# EAGLE schematic tinyRF (EAGLE 6.4)
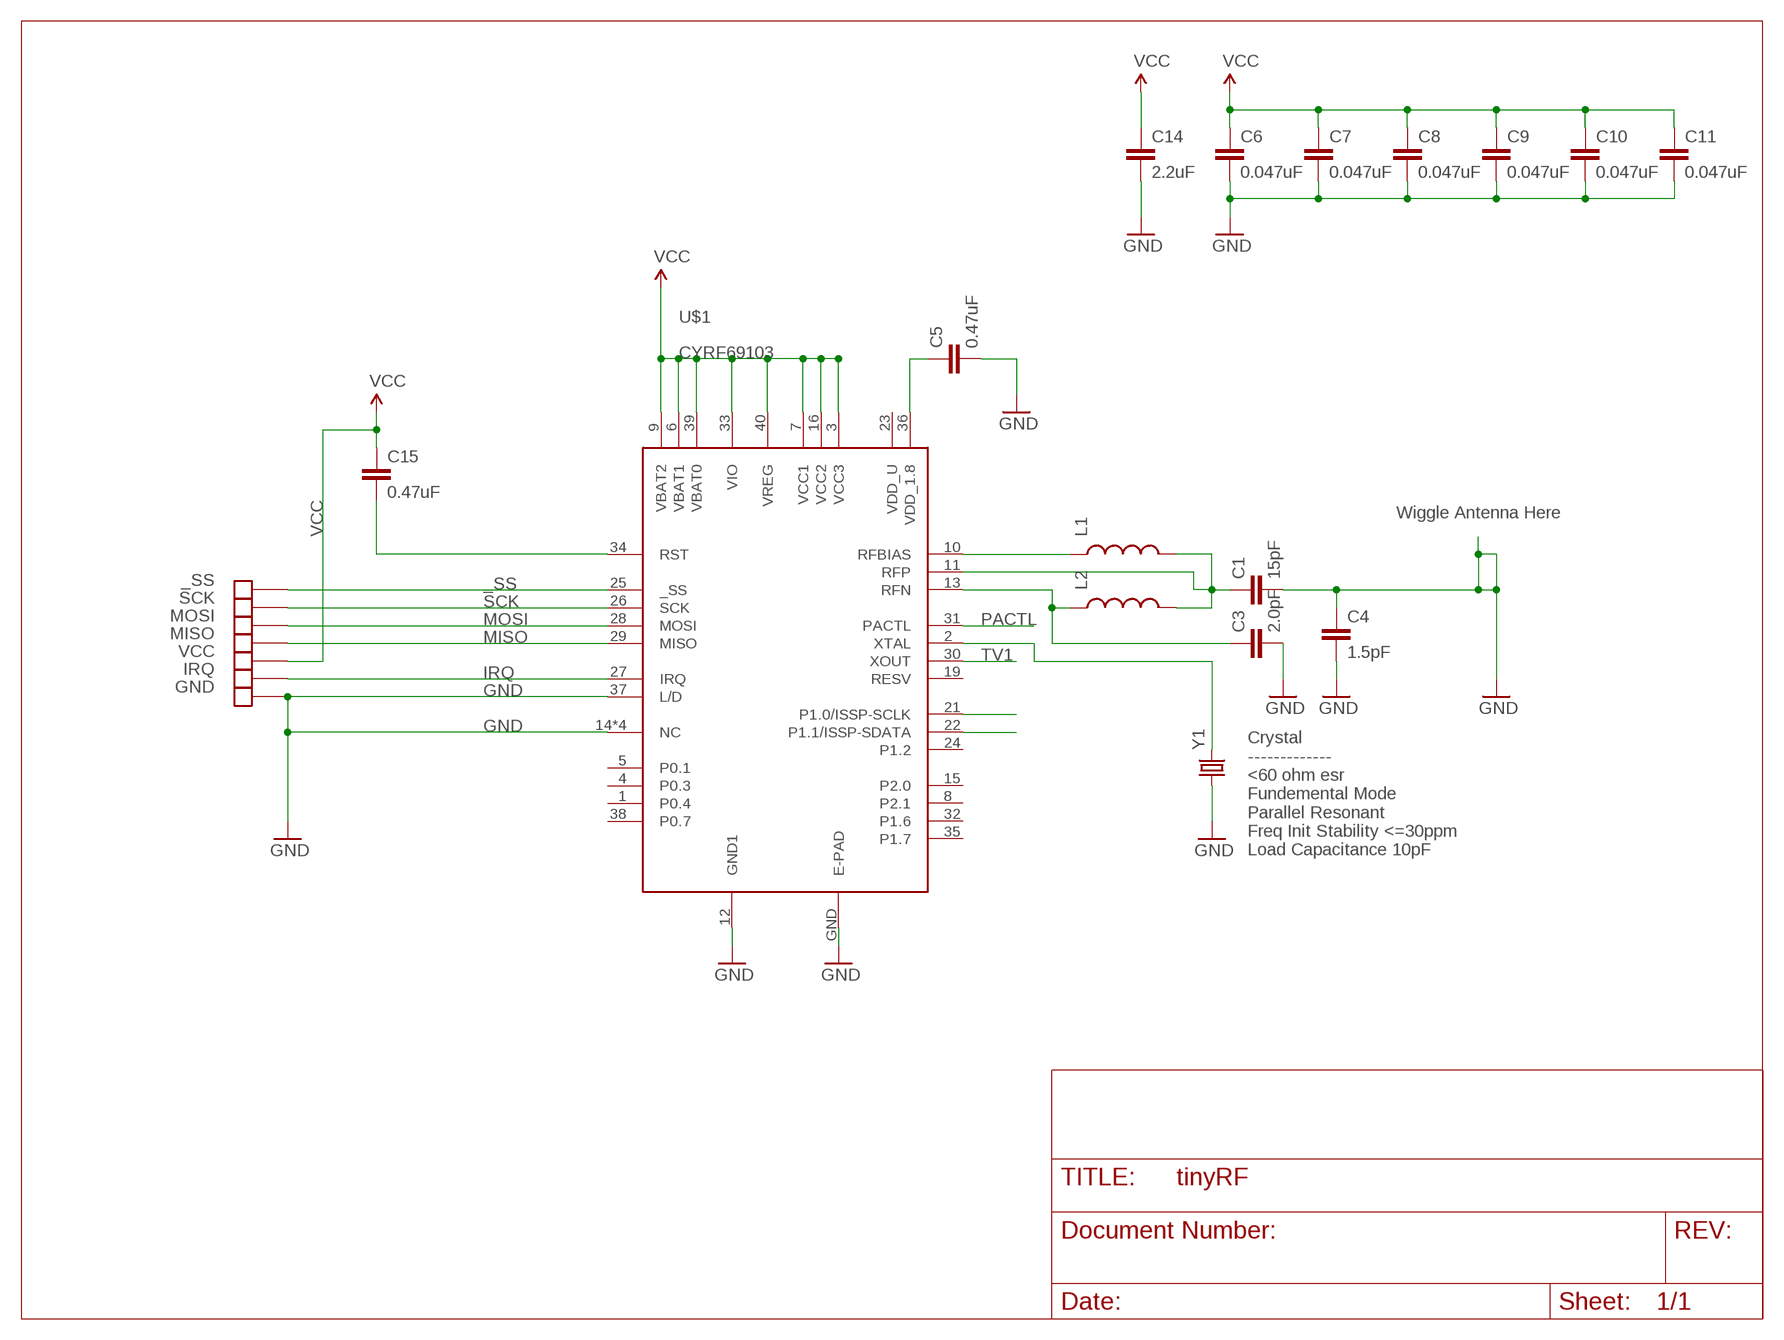
[diagram p0: schematic, sheet 1]

## Parts
_SS  SOLDER_PAD.05X.05  [SOLDER_PAD_.05X.05]
C1  15pF  CAP0402-CAP  [0402-CAP]
C3  2.0pF  CAP0402-CAP  [0402-CAP]
C4  1.5pF  CAP0402-CAP  [0402-CAP]
C5  0.47uF  CAP0402-CAP  [0402-CAP]
C6  0.047uF  CAP0402-CAP  [0402-CAP]
C7  0.047uF  CAP0402-CAP  [0402-CAP]
C8  0.047uF  CAP0402-CAP  [0402-CAP]
C9  0.047uF  CAP0402-CAP  [0402-CAP]
C10  0.047uF  CAP0402-CAP  [0402-CAP]
C11  0.047uF  CAP0402-CAP  [0402-CAP]
C14  2.2uF  CAP0805  [0805]
C15  0.47uF  CAP0402-CAP  [0402-CAP]
GND  SOLDER_PAD.05X.05  [SOLDER_PAD_.05X.05]
IRQ  SOLDER_PAD.05X.05  [SOLDER_PAD_.05X.05]
L1  INDUCTOR0603  [0603]
L2  INDUCTOR0402  [C0402]
MISO  SOLDER_PAD.05X.05  [SOLDER_PAD_.05X.05]
MOSI  SOLDER_PAD.05X.05  [SOLDER_PAD_.05X.05]
SCK  SOLDER_PAD.05X.05  [SOLDER_PAD_.05X.05]
U$1  CYRF69103  [QFN40]
VCC  SOLDER_PAD.05X.05  [SOLDER_PAD_.05X.05]
Y1  CRYSTAL5X3  [CRYSTAL-SMD-5X3]

## Nets
_SS: _SS.P$1(NET) U$1.25(_SS)
GND: C1.2 C3.2 C4.1 C4.2 C5.2 C6.2 C7.2 C8.2 C9.2 C10.2 C11.2 C14.2 GND.P$1(NET) U$1.12(GND1) U$1.14(NC) U$1.17(NC) U$1.18(NC) U$1.20(NC) U$1.37(L/D) U$1.GND(E-PAD) Y1.1
IRQ: IRQ.P$1(NET) U$1.27(IRQ)
MISO: MISO.P$1(NET) U$1.29(MISO)
MOSI: MOSI.P$1(NET) U$1.28(MOSI)
N$2: U$1.2(XTAL) Y1.3
N$4: U$1.21(P1.0/ISSP-SCLK)
N$5: U$1.22(P1.1/ISSP-SDATA)
RFBIAS: L1.1 U$1.10(RFBIAS)
RFN: C3.1 L2.1 U$1.13(RFN)
RFP: C1.1 L1.2 L2.2 U$1.11(RFP)
RST: C15.2 U$1.34(RST)
SCK: SCK.P$1(NET) U$1.26(SCK)
VCC: C6.1 C7.1 C8.1 C9.1 C10.1 C11.1 C14.1 C15.1 U$1.3(VCC3) U$1.6(VBAT1) U$1.7(VCC1) U$1.9(VBAT2) U$1.16(VCC2) U$1.33(VIO) U$1.39(VBAT0) U$1.40(VREG) VCC.P$1(NET)
VDD: C5.1 U$1.36(VDD_1.8)
Unconnected: U$1.1(P0.4) U$1.4(P0.3) U$1.5(P0.1) U$1.8(P2.1) U$1.15(P2.0) U$1.19(RESV) U$1.23(VDD_U) U$1.24(P1.2) U$1.30(XOUT) U$1.31(PACTL) U$1.32(P1.6) U$1.35(P1.7) U$1.38(P0.7)

## Notes on the sheet
- Wiggle Antenna Here
- Crystal
  -------------
  <60 ohm esr
  Fundemental Mode
  Parallel Resonant
  Freq Init Stability <=30ppm
  Load Capacitance 10pF

## Library data of the parts
_SS GND IRQ MISO MOSI SCK VCC = JCM:SOLDER_PAD
C1 = SparkFun-Passives:CAP: Capacitor Standard 0603 ceramic capacitor, and 0.1" leaded capacitor.; PARTNO: C0402C150J5GACTU; VOLT: 50
C3 = SparkFun-Passives:CAP: Capacitor Standard 0603 ceramic capacitor, and 0.1" leaded capacitor.; PARTNO: C0402C209C5GACTU; VOLT: 50
C4 = SparkFun-Passives:CAP: Capacitor Standard 0603 ceramic capacitor, and 0.1" leaded capacitor.; PARTNO: C0402C159B5GACTU; VOLT: 50
C5 C15 = SparkFun-Passives:CAP: Capacitor Standard 0603 ceramic capacitor, and 0.1" leaded capacitor.; PARTNO: GRM155R60J474KE19D; VOLT: 6.3
C6-C11 = SparkFun-Passives:CAP: Capacitor Standard 0603 ceramic capacitor, and 0.1" leaded capacitor.; PARTNO: 0402YD473KAT2A
C14 = SparkFun-Passives:CAP: Capacitor Standard 0603 ceramic capacitor, and 0.1" leaded capacitor.; PARTNO: GRM21BR71A225KA01L
L1 = SparkFun-Passives:INDUCTOR: Inductors Basic Inductor/Choke - 0603 and 1206. Footprints are not proven and vary greatly between part numbers.; PARTNO: ELJ-RE22NGFA
L2 = SparkFun-Passives:INDUCTOR: Inductors Basic Inductor/Choke - 0603 and 1206. Footprints are not proven and vary greatly between part numbers.; PARTNO: ELJ-RF1N8DFB
U$1 = JCM:CYRF69103
Y1 = SparkFun-FreqCtrl:CRYSTAL: Various standard crystals. Proven footprints. Spark Fun Electronics SKU : COM-00534; PARTNO: 7B-12.000MEEQ-T